# EAGLE design Air_Wheel_3 (EAGLE 9.6.2)
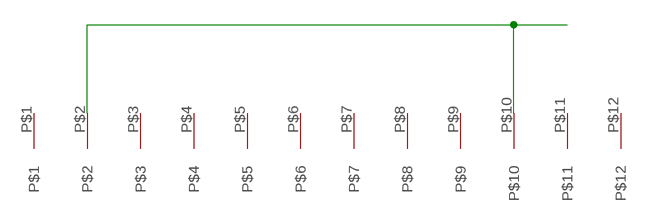
[diagram p0: schematic, sheet 1]

## Parts
U$1  BEAST  [BEAST]

## Nets
N$1: U$1.P$2 U$1.P$10
Unconnected: U$1.P$1 U$1.P$3 U$1.P$4 U$1.P$5 U$1.P$6 U$1.P$7 U$1.P$8 U$1.P$9 U$1.P$11 U$1.P$12

## Library data of the parts
U$1 = beastpins:BEAST

## Board
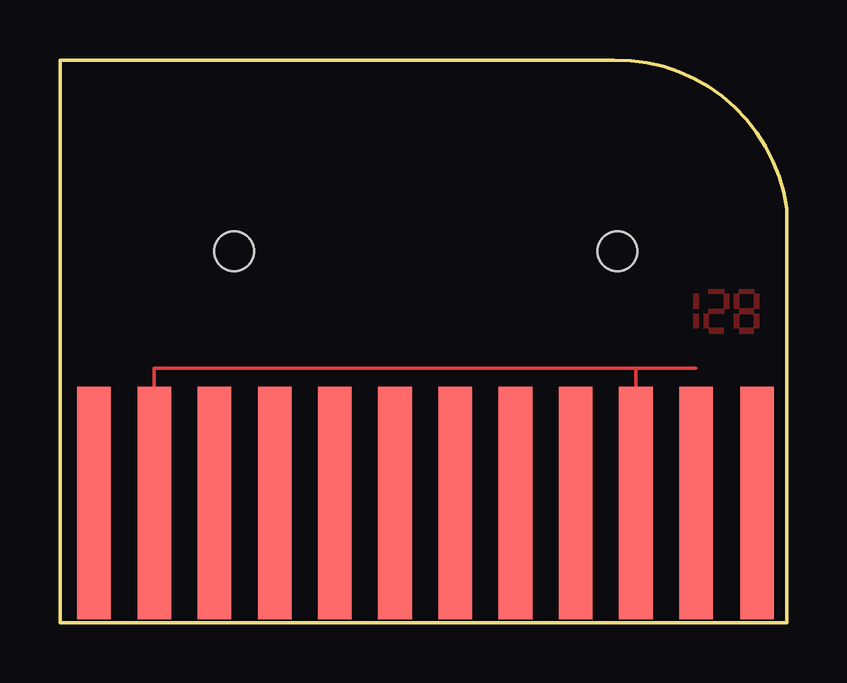
[diagram p1: board, top side]

Size 30.3 x 23.45 mm. Coordinates in mm from the lower left corner, seen from the top.
Outline: 0,0 30.3,0 30.3,17.25 arc83 23.1,23.45 0,23.45 0,0
Copper layers (1*16): Top 0.035mm / dielectric 1.5mm / Bottom 0.035mm
Design rules "default *": minimum track width 6mil, minimum drill 0.35mm, track to track 1mil, track to pad 6mil, pad to pad 6mil, via to via 6mil, smd to smd 6mil, copper to edge 0.002540625mm, drill to drill 1mil, minimum pad ring 10mil, minimum via ring 8mil, stop-mask expansion 4mil, vias tented up to drill 0mil, thermal gap 10mil
Holes 1.65 mm at 7.27,15.49 23.23,15.49

### Footprints (pad centres in the part's own frame; a part is rotated, then mirrored left to right if it is on the bottom)
BEAST = smd 1.4 x 9.7: P$1 -27.61,5.02; P$2 -25.1,5.02; P$3 -22.59,5.02; P$4 -20.08,5.02; P$5 -17.57,5.02; P$6 -15.06,5.02; P$7 -12.55,5.02; P$8 -10.04,5.02; P$9 -7.53,5.02; P$10 -5.02,5.02; P$11 -2.51,5.02; P$12 0.03,5.02

### Placement (x,y rotation side)
U$1  29.03,-0.03 0 top

### Tracks (layer width: path | path; a pad name or v marks a point on that pad's centre or on a via)
N$1
  Top 0.152: 24.04,10.6 3.93,10.6 U$1.P$2 | 24.04,10.6 26.52,10.6 | U$1.P$10 24.01,10.57 24.04,10.6
N$2
  pour Top: 27.06,12.27 27.06,12.07 27.67,12.07 27.67,12.27
N$3
  pour Top: 27.04,12.27 26.86,12.27 26.86,12.89 27.04,12.89
N$4
  pour Top: 27.88,13.09 27.69,13.09 27.69,13.7 27.88,13.7
N$5
  pour Top: 27.67,13.7 27.06,13.7 27.06,13.91 27.67,13.91
N$6
  pour Top: 28.93,13.7 28.31,13.7 28.31,13.91 28.93,13.91
N$7
  pour Top: 29.13,13.09 28.95,13.09 28.95,13.7 29.13,13.7
N$8
  pour Top: 28.31,13.09 28.31,12.89 28.93,12.89 28.93,13.09
N$9
  pour Top: 28.29,12.27 28.11,12.27 28.11,12.89 28.29,12.89
N$10
  pour Top: 28.31,12.27 28.31,12.07 28.93,12.07 28.93,12.27
N$11
  pour Top: 29.13,12.27 28.95,12.27 28.95,12.89 29.13,12.89
N$12
  pour Top: 26.62,12.27 26.42,12.27 26.42,12.89 26.62,12.89
N$15
  pour Top: 26.62,13.09 26.42,13.09 26.42,13.7 26.62,13.7
N$24
  pour Top: 27.67,12.89 27.06,12.89 27.06,13.09 27.67,13.09
N$39
  pour Top: 28.3,13.09 28.11,13.09 28.11,13.7 28.3,13.7